# Altium schematic sheet DIO.SchDoc
size A4
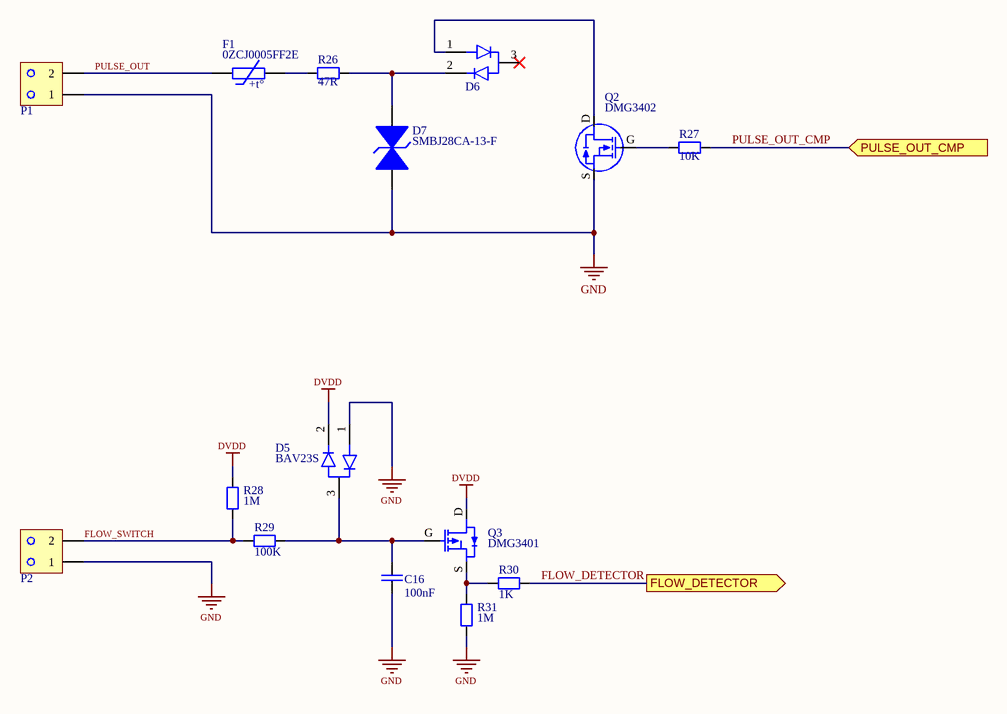
[diagram p0: DIO.SchDoc]

## Parts
C16  100nF  [CAP_SM0805_YAGEOCC2_N]
D5  BAV23S  [BAV23S]
D6  BAV23S  [BAV23S]  (value not drawn)
D7  SMBJ28CA-13-F  [SMBJ28CA-13-F]
F1  0ZCJ0005FF2E  [0ZCJ0005FF2E]
P1  WJ15EDGVC-3.81-2P  [HEADER PLUG 2]  (value not drawn)
P2  WJ15EDGVC-3.81-2P  [HEADER PLUG 2]  (value not drawn)
Q2  DMG3402  [DMG3402L-7]
Q3  DMG3401  [DMG3401LSN-7]
R26  47R  [RES_SM0805_YAGEORC_N]
R27  10K  [RES_SM0805_YAGEORC_N]
R28  1M  [RES_SM0805_YAGEORC_N]
R29  100K  [RES_SM0805_YAGEORC_N]
R30  1K  [RES_SM0805_YAGEORC_N]
R31  1M  [RES_SM0805_YAGEORC_N]

## Ports
FLOW_DETECTOR (out), PULSE_OUT_CMP (in)

## Nets
DVDD: D5.2 Q3.D R28.2
GND: C16.2 D5.1 D7.A P1.1 P2.1 Q2.S R31.1
FLOW_DETECTOR: R30.2 ; port FLOW_DETECTOR
FLOW_SWITCH: P2.2 R28.1 R29.1
PULSE_OUT: F1.1 P1.2
PULSE_OUT_CMP: R27.1 ; port PULSE_OUT_CMP
NetC16_1: C16.1 D5.3 Q3.G R29.2
NetD6_1: D6.1 Q2.D
NetD6_2: D6.2 D7.K R26.1
NetF1_2: F1.2 R26.2
NetQ2_G: Q2.G R27.2
NetQ3_S: Q3.S R30.1 R31.2

Not connected (* = marked no-connect by the designer): D6 3*

## Notes on the sheet
- (in symbol 0ZCJ0005FF2E) +t°

## Library data of the parts
C16 = CC0805KRX7R8BB104: CAP 100nF SM0805 X7R 25V YAGEO CC2; Tolerance (%): 10; Voltage Rating (Volts): 25; Category: Capacitor; Manufacturer: Yageo; Manufacturer Part Number: CC0805KRX7R8BB104; Package: 0805; Value: 100nF; Supplier Part Number 1: 644249; Supplier 1: Farnell; ComponentLink1URL: http://www.yageo.com; ComponentLink1Description: Manufacturer Website; Supplier 2: Digi-Key; Supplier Part Number 2: 311-1141-1-ND; Datasheet: https://datasheet.lcsc.com/lcsc/2006111832_YAGEO-CC0805KRX7R8BB104_C519981.pdf
D5 D6 = BAV23S: DIODE ARRAY GP 250V 200MA SOT23; Manufacturer: onsemi; Manufacturer Part Number: BAV23S; Category: Diodo; Datasheet: https://www.onsemi.com/pdf/datasheet/bav23s-d.pdf; Temperature Max: 150; Temperature Min: -55
D7 = SMBJ28CA-13-F: Manufacturer: Diodes Incorporated; Manufacturer Part Number: SMBJ24CA; Value: 24V - 26.7V - 38.9V; Category: Diodo; Datasheet: https://datasheet.lcsc.com/lcsc/2304140030_Diodes-Incorporated-SMBJ28CA-13-F_C135064.pdf; Temperature Max: 150; Temperature Min: -55
F1 = 0ZCJ0005FF2E: PTC RESET FUSE 60V 50MA 1206; Manufacturer: Bel Fuse Inc.; Manufacturer Part Number: 0ZCJ0005FF2E; Category: Fusible; Datasheet: https://www.belfuse.com/resources/datasheets/circuitprotection/ds-cp-0zcj-series.pdf; Temperature Max: 85; Temperature Min: -40
P1 P2 = WJ15EDGVC-3.81-2P: TERM BLOK FEMALE 1X2 3.81MM; Manufacturer: Ningbo Kangnex Elec; Manufacturer Part Number: WJ15EDGVC-3.81-2P; Category: Bornera enchufable; Datasheet: https://datasheet.lcsc.com/lcsc/1912251633_Ningbo-Kangnex-Elec-WJ15EDGVC-3-81-2P_C8396.pdf; Temperature Max: 105; Temperature Min: -40
Q2 = DMG3402L-7: N-CHANNEL ENHANCEMENT MODE FIELD EFFECT TRANSISTOR / 85mΩ @ VGS = 2.5V -> ID 2A / V(BR)DDS 30V; Manufacturer: Diodes Incorporated; Category: Transistor mosfet; Manufacturer Part Number: DMG3402L-7; Datasheet: https://www.diodes.com/assets/Datasheets/DMG3402L.pdf; Temperature Max: 150; Temperature Min: -55
Q3 = DMG3401LSN-7: P-CHANNEL ENHANCEMENT MODE MOSFET / RDS(ON) = 85mΩ @ VGS = -2.5V -> ID -2.7A / V(BR)DDS 30V; Manufacturer: Diodes Incorporated; Category: Transistor mosfet; Manufacturer Part Number: DMG3401LSN-7; Datasheet: https://www.diodes.com/assets/Datasheets/DMG3401LSN.pdf; Temperature Max: 150; Temperature Min: -55
R26 = RC0805FR-0747RL: RES 47R SM0805 YAGEO RC_L; Power (Watts): 0.125; Resistance (Ohms): 47; Tolerance (%): 1; Category: Resistor; Manufacturer: Yageo; Manufacturer Part Number: RC0805FR-0747RL; Package: 0805; Value: 47R; Supplier Part Number 1: 9237321; Supplier 1: Farnell; ComponentLink1Description: Manufacturer Website; ComponentLink1URL: http://www.yageo.com; Supplier 2: Digi-Key; Supplier Part Number 2: 311-47.0CRCT-ND; Datasheet: https://www.yageo.com/upload/media/product/app/datasheet/rchip/pyu-rc_group_51_rohs_l.pdf
R27 = RC0805FR-0710KL: RES 10K SM0805 YAGEO RC_L; Power (Watts): 0.125; Resistance (Ohms): 10000; Tolerance (%): 1; Category: Resistor; Manufacturer: Yageo; Manufacturer Part Number: RC0805FR-0710KL; Package: 0805; Value: 10K; Supplier Part Number 1: 9237755; Supplier 1: Farnell; ComponentLink1Description: Manufacturer Website; ComponentLink1URL: http://www.yageo.com; Supplier 2: Digi-Key; Supplier Part Number 2: 311-10.0KCRCT-ND; Datasheet: https://www.yageo.com/upload/media/product/app/datasheet/rchip/pyu-rc_group_51_rohs_l.pdf
R28 R31 = RC0805FR-071ML: RES 1M SM0805 YAGEO RC_L; Power (Watts): 0.125; Resistance (Ohms): 1000000; Tolerance (%): 1; Category: Resistor; Manufacturer: Yageo; Manufacturer Part Number: RC0805FR-071ML; Package: 0805; Value: 1M; Supplier Part Number 1: 9237992; Supplier 1: Farnell; ComponentLink1URL: http://www.yageo.com; ComponentLink1Description: Manufacturer Website; Supplier 2: Digi-Key; Supplier Part Number 2: 311-1.00MCRCT-ND; Datasheet: https://www.yageo.com/upload/media/product/productsearch/datasheet/rchip/PYu-RC_Group_51_RoHS_L_12.pdf
R29 = RC0805FR-07100KL: RES 100K SM0805 YAGEO RC_L; Power (Watts): 0.125; Resistance (Ohms): 100000; Tolerance (%): 1; Category: Resistor; Manufacturer: Yageo; Manufacturer Part Number: RC0805FR-07100KL; Package: 0805; Value: 100K; Supplier Part Number 1: 9237879; Supplier 1: Farnell; ComponentLink1Description: Manufacturer Website; ComponentLink1URL: http://www.yageo.com; Supplier 2: Digi-Key; Supplier Part Number 2: 311-100KCRCT-ND; Datasheet: https://www.yageo.com/upload/media/product/app/datasheet/rchip/pyu-rc_group_51_rohs_l.pdf
R30 = RC0805FR-071KL: RES 1K SM0805 YAGEO RC_L; Power (Watts): 0.125; Resistance (Ohms): 1000; Tolerance (%): 1; Category: Resistor; Manufacturer: Yageo; Manufacturer Part Number: RC0805FR-071KL; Package: 0805; Value: 1K; Supplier Part Number 1: 9237496; Supplier 1: Farnell; ComponentLink1URL: http://www.yageo.com; ComponentLink1Description: Manufacturer Website; Supplier 2: Digi-Key; Supplier Part Number 2: 311-1.00KCRCT-ND; Datasheet: https://www.yageo.com/upload/media/product/app/datasheet/rchip/pyu-rc_group_51_rohs_l.pdf